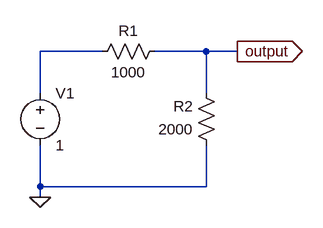
[diagram p0: schematic voltage_divider.asc]
voltage_divider.asc, the LTspice schematic file:
Version 4
SHEET 1 880 680
WIRE 208 32 112 32
WIRE 368 32 288 32
WIRE 416 32 368 32
WIRE 112 96 112 32
WIRE 368 96 368 32
WIRE 112 240 112 176
WIRE 368 240 368 176
WIRE 368 240 112 240
WIRE 112 256 112 240
FLAG 112 256 0
FLAG 416 32 output
IOPIN 416 32 Out
SYMBOL voltage 112 80 R0
WINDOW 123 0 0 Left 0
WINDOW 39 0 0 Left 0
SYMATTR InstName V1
SYMATTR Value 1
SYMBOL res 304 16 R90
WINDOW 0 0 56 VBottom 2
WINDOW 3 32 56 VTop 2
SYMATTR InstName R1
SYMATTR Value 1000
SYMBOL res 384 192 R180
WINDOW 0 36 76 Left 2
WINDOW 3 36 40 Left 2
SYMATTR InstName R2
SYMATTR Value 2000

The netlist it stands for:
* voltage_divider.asc
V1 N001 0 1
R1 output N001 1000
R2 0 output 2000
.backanno
.end